# EAGLE design Dust_Sensor_Bypass_adapter (EAGLE 9.6.1)
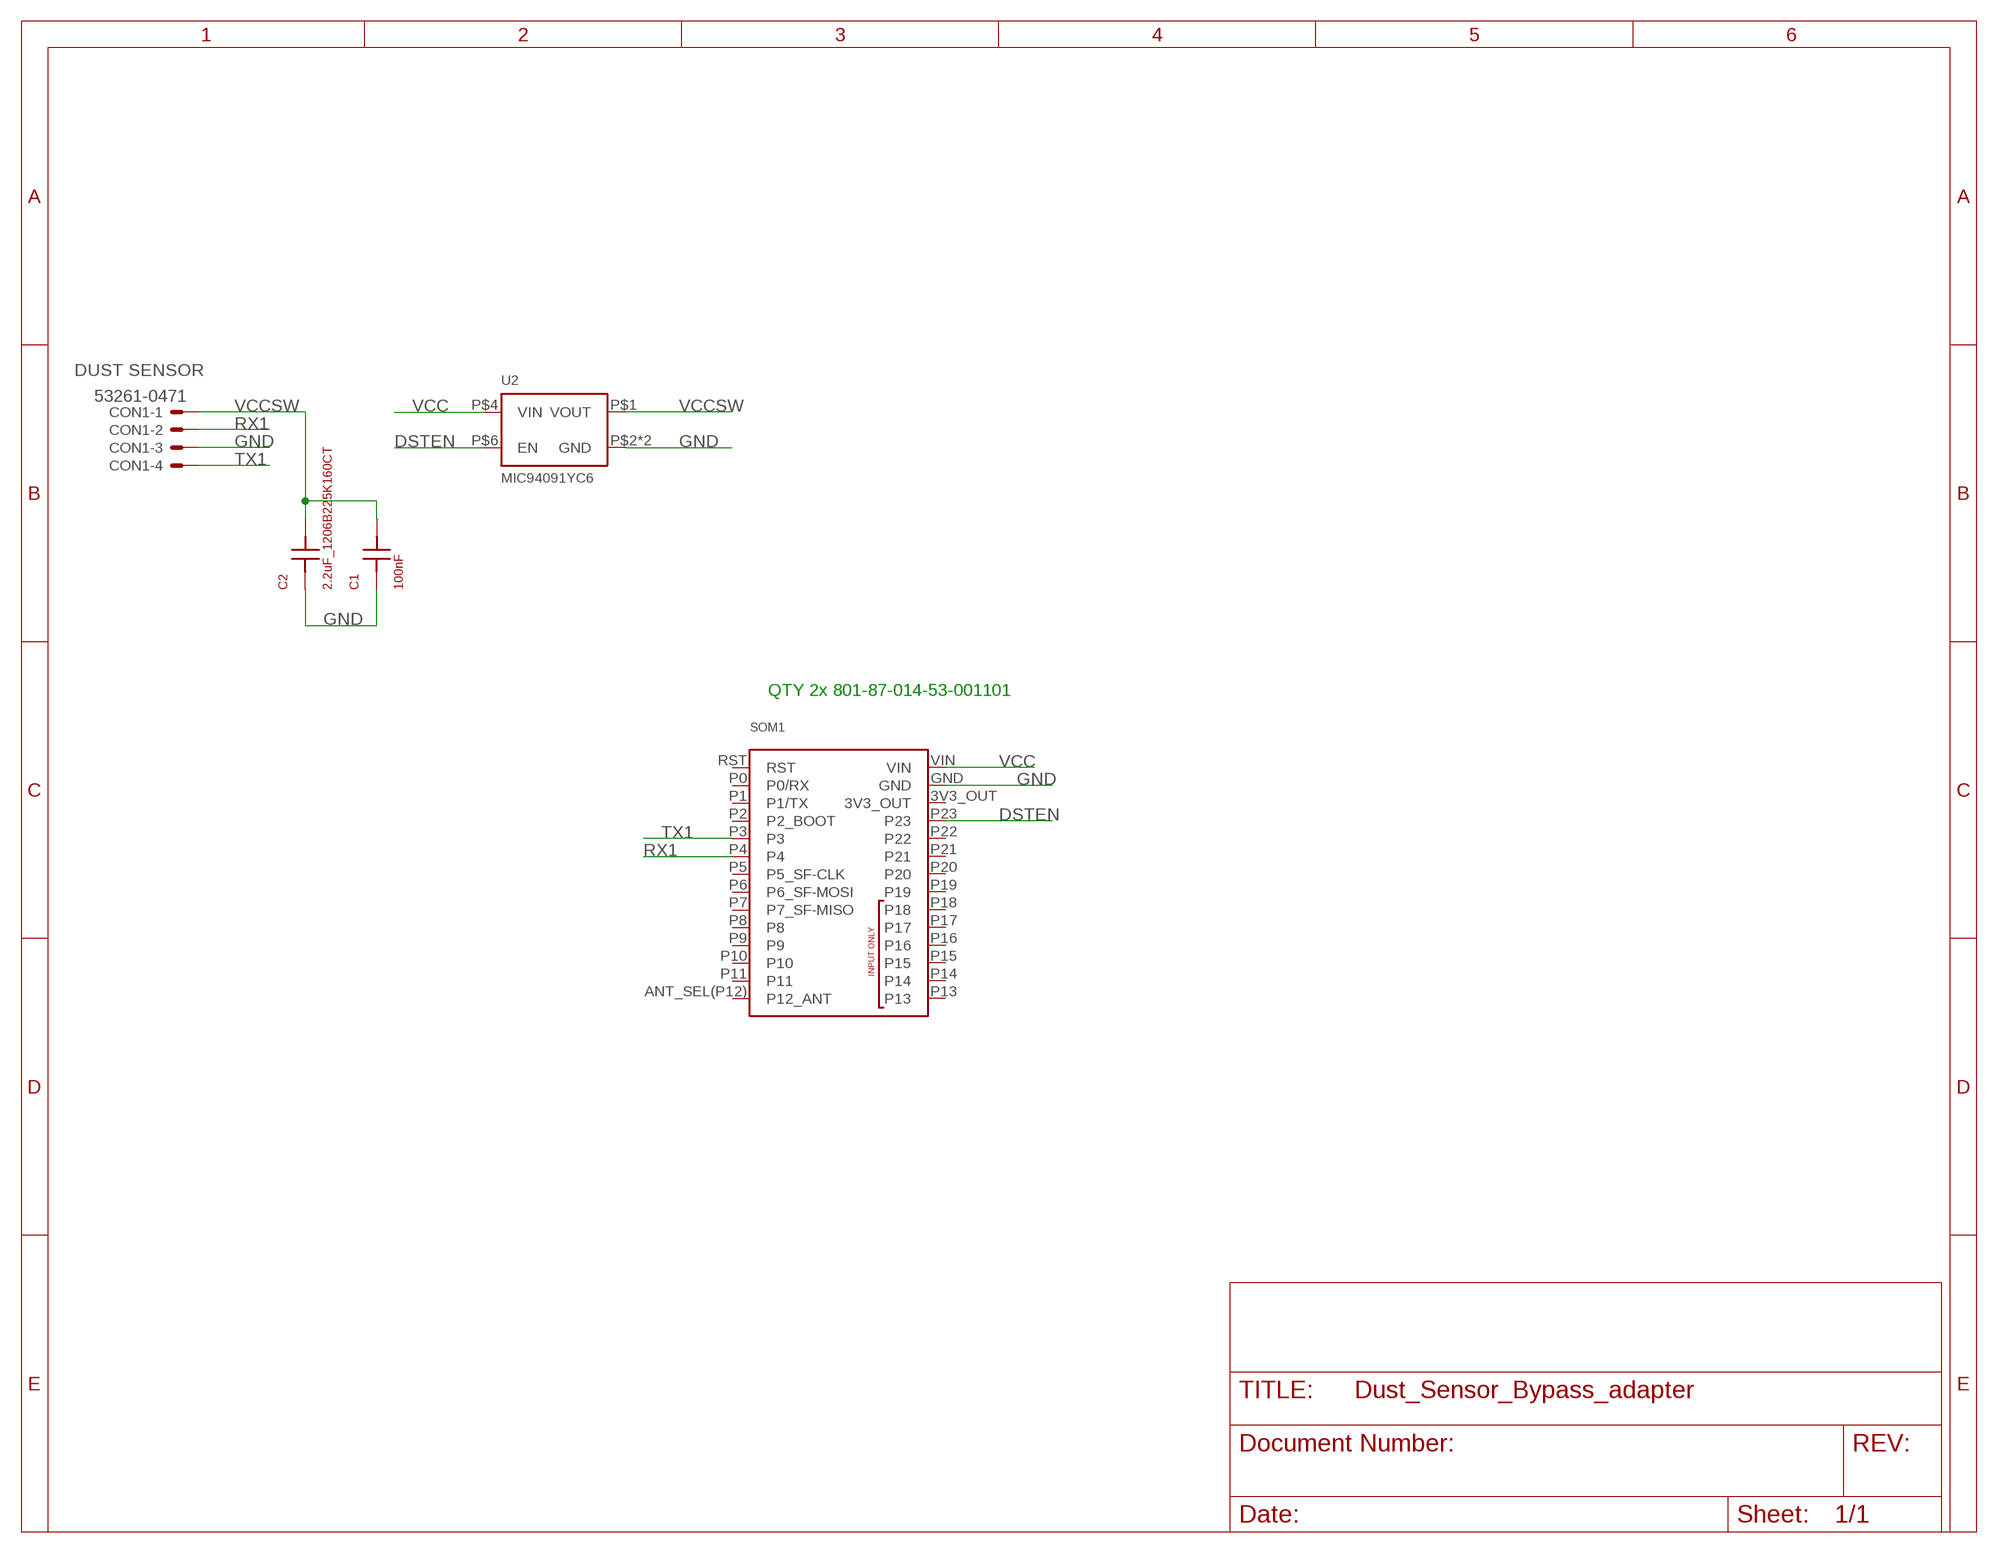
[diagram p0: schematic, sheet 1]

## Parts
C1  100nF  CAP_NP_0603  [SMD_0603]
C2  2.2uF_1206B225K160CT  CAP_NP_1206  [SMD_1206]
CON1  53261-0471  53261-04  [53261-04]
SOM1  PYCOM_LOPY4PTH  [PYCOM_LOPY4_PTH]
U2  MIC94091YC6  MIC9409X-MICREL-HIGH-SIDE-LOAD-SW_SC70(C6)  [SC-70(C6)]

## Nets
DSTEN: SOM1.P23 U2.P$6(EN)
GND: C1.P$1 C2.P$1 CON1.3 SOM1.GND U2.P$2(GND) U2.P$5(GND)
RX1: CON1.2 SOM1.P4
TX1: CON1.4 SOM1.P3
VCC: SOM1.VIN U2.P$4(VIN)
VCCSW: C1.P$2 C2.P$2 CON1.1 U2.P$1(VOUT)
Unconnected: SOM1.ANT_SEL(P12)(P12_ANT) SOM1.P0(P0/RX) SOM1.P1(P1/TX) SOM1.P2(P2_BOOT) SOM1.P5(P5_SF-CLK) SOM1.P6(P6_SF-MOSI) SOM1.P7(P7_SF-MISO) SOM1.P8 SOM1.P9 SOM1.P10 SOM1.P11 SOM1.P13 SOM1.P14 SOM1.P15 SOM1.P16 SOM1.P17 SOM1.P18 SOM1.P19 SOM1.P20 SOM1.P21 SOM1.P22 SOM1.RST

## Notes on the sheet
- DUST SENSOR
- QTY 2x 801-87-014-53-001101

## Power pins joined to a net without a drawn wire
3V3_OUT: SOM1.3V3_OUT

## Library data of the parts
C1 C2 = daneagle_db8.0:CAP_NP
CON1 = con-molex:53?-04: CONNECTOR wire to board 1.25 mm (.049 inch) pitch header; MF: MOLEX; OC_FARNELL: 1125374; OC_NEWARK: unknown
SOM1 = daneagle_db8.0:PYCOM_LOPY4
U2 = daneagle_db8.0:MIC9409X-MICREL-HIGH-SIDE-LOAD-SW

## Board
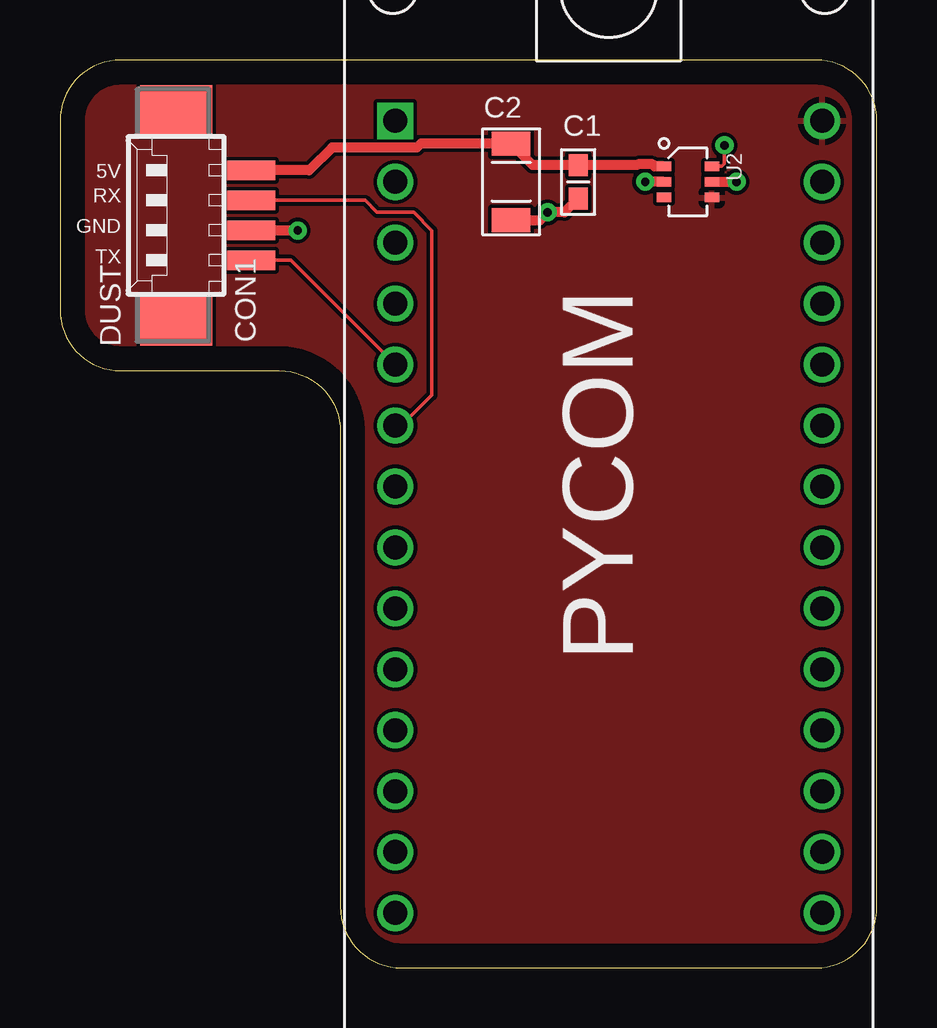
[diagram p1: board, top side]
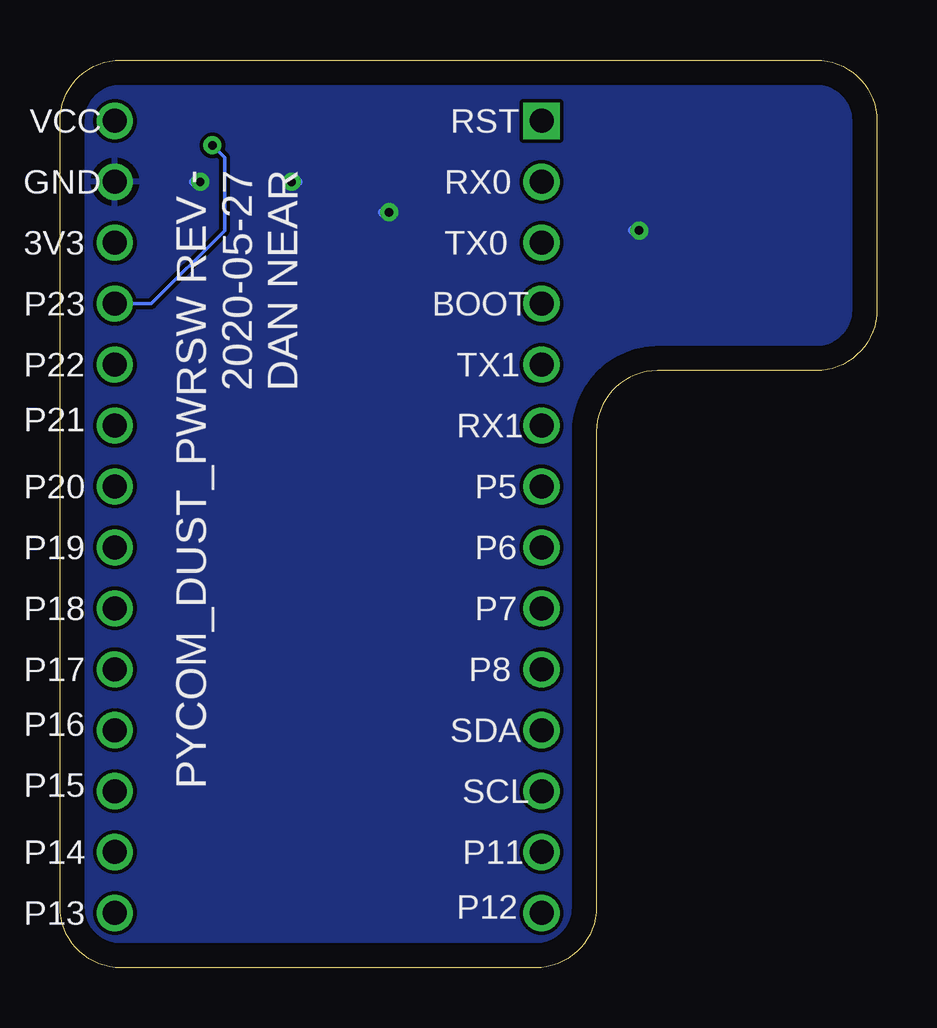
[diagram p2: board, bottom side, seen from below]

Size 34.04 x 37.85 mm. Coordinates in mm from the lower left corner, seen from the top.
Outline: 11.68,22.35 11.68,2.54 arc90 14.22,0 31.5,0 arc90 34.04,2.54 34.04,35.31 arc90 31.5,37.85 2.54,37.85 arc90 0,35.31 0,27.43 arc90 2.54,24.89 9.14,24.89 arc-90 11.68,22.35
Copper layers (1*16): Top 0.035mm / dielectric 1.5mm / Bottom 0.035mm
Design rules "default": minimum track width 6mil, minimum drill 0.35mm, track to track 6mil, track to pad 6mil, pad to pad 6mil, via to via 6mil, smd to smd 6mil, copper to edge 40mil, drill to drill 6mil, minimum pad ring 10mil, minimum via ring 8mil, stop-mask expansion 4mil, vias tented up to drill 0mil, thermal gap 10mil

### Footprints (pad centres in the part's own frame; a part is rotated, then mirrored left to right if it is on the bottom)
SMD_0603 = smd 0.914 x 0.8: P$1 -0.701,0; P$2 0.701,0
SMD_1206 = smd 1 x 1.6: P$1 -1.6,0; P$2 1.6,0
53261-04 = smd 0.8 x 2: 1 1.875,-2.5; 2 0.625,-2.5; 3 -0.625,-2.5; 4 -1.875,-2.5 | smd 2.1 x 3: S1 4.375,0.625; S2 -4.375,0.625
PYCOM_LOPY4_PTH = drill 1: 3V3_OUT 8.89,11.43; ANT_SEL(P12) -8.89,-16.51; GND 8.89,13.97; P0 -8.89,13.97; P1 -8.89,11.43; P2 -8.89,8.89; P3 -8.89,6.35; P4 -8.89,3.81; P5 -8.89,1.27; P6 -8.89,-1.27; P7 -8.89,-3.81; P8 -8.89,-6.35; P9 -8.89,-8.89; P10 -8.89,-11.43; P11 -8.89,-13.97; P13 8.89,-16.51; P14 8.89,-13.97; P15 8.89,-11.43; P16 8.89,-8.89; P17 8.89,-6.35; P18 8.89,-3.81; P19 8.89,-1.27; P20 8.89,1.27; P21 8.89,3.81; P22 8.89,6.35; P23 8.89,8.89; VIN 8.89,16.51 | drill 1 square: RST -8.89,16.51
SC-70(C6) = smd 0.4 x 0.6: P$1 -0.65,-1; P$2 0,-1; P$3 0.65,-1; P$4 0.65,1; P$5 0,1; P$6 -0.65,1

### Placement (x,y rotation side)
C1  21.59,32.77 90 top
C2  18.8,32.77 90 top
CON1  5.46,31.37 90 top
SOM1  22.86,18.8 0 top
U2  26.16,32.77 270 top

### Tracks (layer width: path | path; a pad name or v marks a point on that pad's centre or on a via)
DSTEN  (via drill 0.35)
  Top 0.152: v27.69,34.29 27.69,33.53 27.57,33.42 U2.P$6
  Bottom 0.152: SOM1.P23 30.23,27.69 27.18,30.73 27.18,33.78 v27.69,34.29
GND  (via drill 0.35)
  Top 0.406: U2.P$2 v24.38,32.77 | U2.P$5 v28.19,32.77 | CON1.3 9.9,30.74 v9.91,30.73 | C2.P$1 19.99,31.17 v20.32,31.5 21.02,31.5 C1.P$1
  Bottom 0.406: v24.38,32.77 24.13,32.77 | v28.19,32.77 28.45,32.77 | v9.91,30.73 10.16,30.73 | v20.32,31.5 20.57,31.5
  pour Bottom: 0,50.8 0,-14.22 21.34,-14.22 21.34,-3.05 35.05,-3.05 35.05,50.8
RX1
  Top 0.152: CON1.2 12.71,31.99 13.21,31.5 14.73,31.5 15.49,30.73 15.49,23.88 14.22,22.61 SOM1.P4
TX1
  Top 0.152: CON1.4 9.62,29.49 SOM1.P3
VCC
  pour Top: 35,37.03 35,50.78 0,50.78 0,-14.22 21.25,-14.22 21.25,-2.97 35,-2.97 35,27.03
VCCSW
  Top 0.406: U2.P$1 24.77,33.42 24.69,33.5 24.08,33.5 24.05,33.47 C1.P$2 19.7,33.47 C2.P$2 15.04,34.37 14.87,34.2 11.34,34.2 10.38,33.24 CON1.1

### Text on the board
tNames: 5V | RX | GND | TX | DUST
bNames: RST | VCC | PYCOM_DUST_PWRSW REV - / 2020-05-27 / DAN NEAR | RX0 | GND | TX0 | 3V3 | BOOT | P23 | TX1 | P22 | P21 | RX1 | P5 | P20 | P6 | P19 | P7 | P18 | P8 | P17 | SDA | P16 | SCL | P15 | P11 | P14 | P12 | P13
Reference: .2 | 1.7 | 2.7 | 2.55 | 2.4 | .2 | .2 | 2.5